# Altium schematic sheet 04-POWERV2.3.SchDoc
size A4
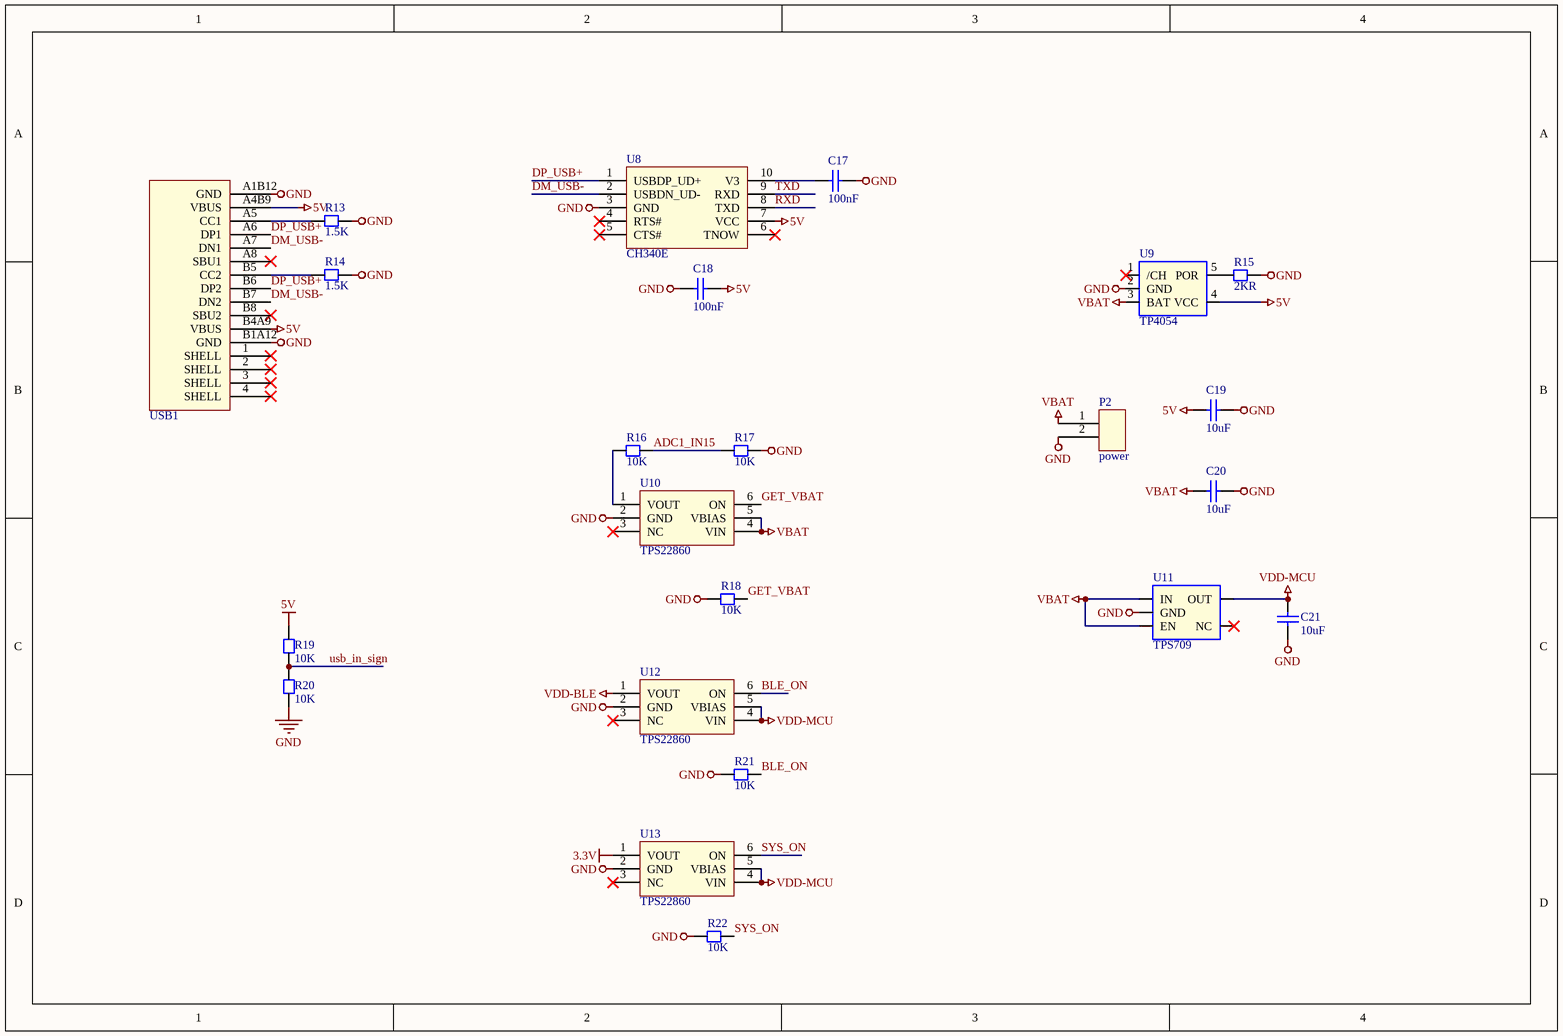
[diagram p0: 04-POWERV2.3.SchDoc]

## Parts
C17  100nF  [CC1005-0402]
C18  100nF  [CC1005-0402]
C19  10uF  [CC1005-0402]
C20  10uF  [CC1005-0402]
C21  10uF  [CC1005-0402]
P2  power  [POWER-3.7V]
R13  1.5K  [CR1005-0402]
R14  1.5K  [CR1005-0402]
R15  2KR  [CR1005-0402]
R16  10K  [CR1005-0402]
R17  10K  [CR1005-0402]
R18  10K  [CR1005-0402]
R19  10K  [CR1005-0402]
R20  10K  [CR1005-0402]
R21  10K  [CR1005-0402]
R22  10K  [CR1005-0402]
U8  CH340E  [MSOP-10]
U9  TP4054  [SOT23-5]
U10  TPS22860  [SOT23-6]
U11  TPS709  [SOT23-5]
U12  TPS22860  [SOT23-6]
U13  TPS22860  [SOT23-6]
USB1  Tpye-c 16P  [TYPE-C 16P]  (value not drawn)

## Nets
3.3V: U13.1(VOUT)
5V: C18.2 C19.2 R19.1 U8.7(VCC) U9.4(VCC) USB1.A4B9(VBUS) USB1.B4A9(VBUS)
GND: C17.2 C18.1 C19.1 C20.1 C21.2 P2.2 R13.1 R14.1 R15.1 R17.2 R18.1 R20.2 R21.1 R22.1 U8.3(GND) U9.2(GND) U10.2(GND) U11.2(GND) U12.2(GND) U13.2(GND) USB1.A1B12(GND) USB1.B1A12(GND)
VBAT: C20.2 P2.1 U9.3(BAT) U10.4(VIN) U10.5(VBIAS) U11.1(IN) U11.3(EN)
VDD-BLE: U12.1(VOUT)
VDD-MCU: C21.1 U11.5(OUT) U12.4(VIN) U12.5(VBIAS) U13.4(VIN) U13.5(VBIAS)
ADC1_IN15: R16.1 R17.1
BLE_ON: R21.2 U12.6(ON)
DM_USB-: U8.2(USBDN_UD-) USB1.A7(DN1) USB1.B7(DN2)
DP_USB+: U8.1(USBDP_UD+) USB1.A6(DP1) USB1.B6(DP2)
GET_VBAT: R18.2 U10.6(ON)
RXD: U8.8(TXD)
SYS_ON: R22.2 U13.6(ON)
TXD: U8.9(RXD)
usb_in_sign: R19.2 R20.1
NetC17_1: C17.1 U8.10(V3)
NetR13_2: R13.2 USB1.A5(CC1)
NetR14_2: R14.2 USB1.B5(CC2)
NetR15_2: R15.2 U9.5(POR)
NetR16_2: R16.2 U10.1(VOUT)

Not connected (* = marked no-connect by the designer): U8 4(RTS#)* 5(CTS#)* 6(TNOW)*; U9 1(/CH)*; U10 3(NC)*; U11 4(NC)*; U12 3(NC)*; U13 3(NC)*; USB1 1(SHELL)* 2(SHELL)* 3(SHELL)* 4(SHELL)* A8(SBU1)* B8(SBU2)*

## Library data of the parts
C17-C21 = Chip capacitor: 贴片电容
R13-R22 = Chip resistor: 贴片电阻
U8 = CH340E: usd转串口芯片 MSOP10封装
U9 = TP4054: 迷你充电IC SOT-23-5
U10 U12 U13 = TPS22860: 超低泄漏电流负载开关  超低泄漏电流负载开关 它可支持最大 200mA 的持续电 / 流。 此开关可由一个打开/关闭输入 (ON) 控制
U11 = TPS709: 3.3V降压IC SOT23-5封装 最大输出150ma电流
USB1 = Tpye-c 16P: 16P 封装的TYPE -c接口 4固定插脚 双向